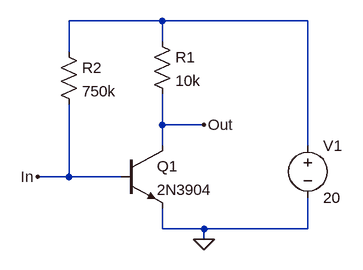
[diagram p0: schematic Draft1.asc]
Draft1.asc, the LTspice schematic file:
Version 4
SHEET 1 880 680
WIRE 224 -48 80 -48
WIRE 448 -48 224 -48
WIRE 224 -16 224 -48
WIRE 80 0 80 -48
WIRE 224 112 224 64
WIRE 288 112 224 112
WIRE 224 144 224 112
WIRE 448 144 448 -48
WIRE 80 192 80 80
WIRE 80 192 32 192
WIRE 160 192 80 192
WIRE 224 272 224 240
WIRE 288 272 224 272
WIRE 448 272 448 224
WIRE 448 272 288 272
WIRE 288 288 288 272
FLAG 288 288 0
FLAG 288 112 Out
FLAG 32 192 In
SYMBOL npn 160 144 R0
SYMATTR InstName Q1
SYMATTR Value 2N3904
SYMBOL res 208 -32 R0
SYMATTR InstName R1
SYMATTR Value 10k
SYMBOL voltage 448 128 R0
SYMATTR InstName V1
SYMATTR Value 20
SYMBOL res 64 -16 R0
SYMATTR InstName R2
SYMATTR Value 750k

The netlist it stands for:
* Draft1.asc
Q1 Out In 0 0 2N3904
R1 N001 Out 10k
V1 N001 0 20
R2 N001 In 750k
.model NPN NPN
.model PNP PNP
.lib standard.bjt
.backanno
.end